# EAGLE design A (EAGLE 7.5.0)
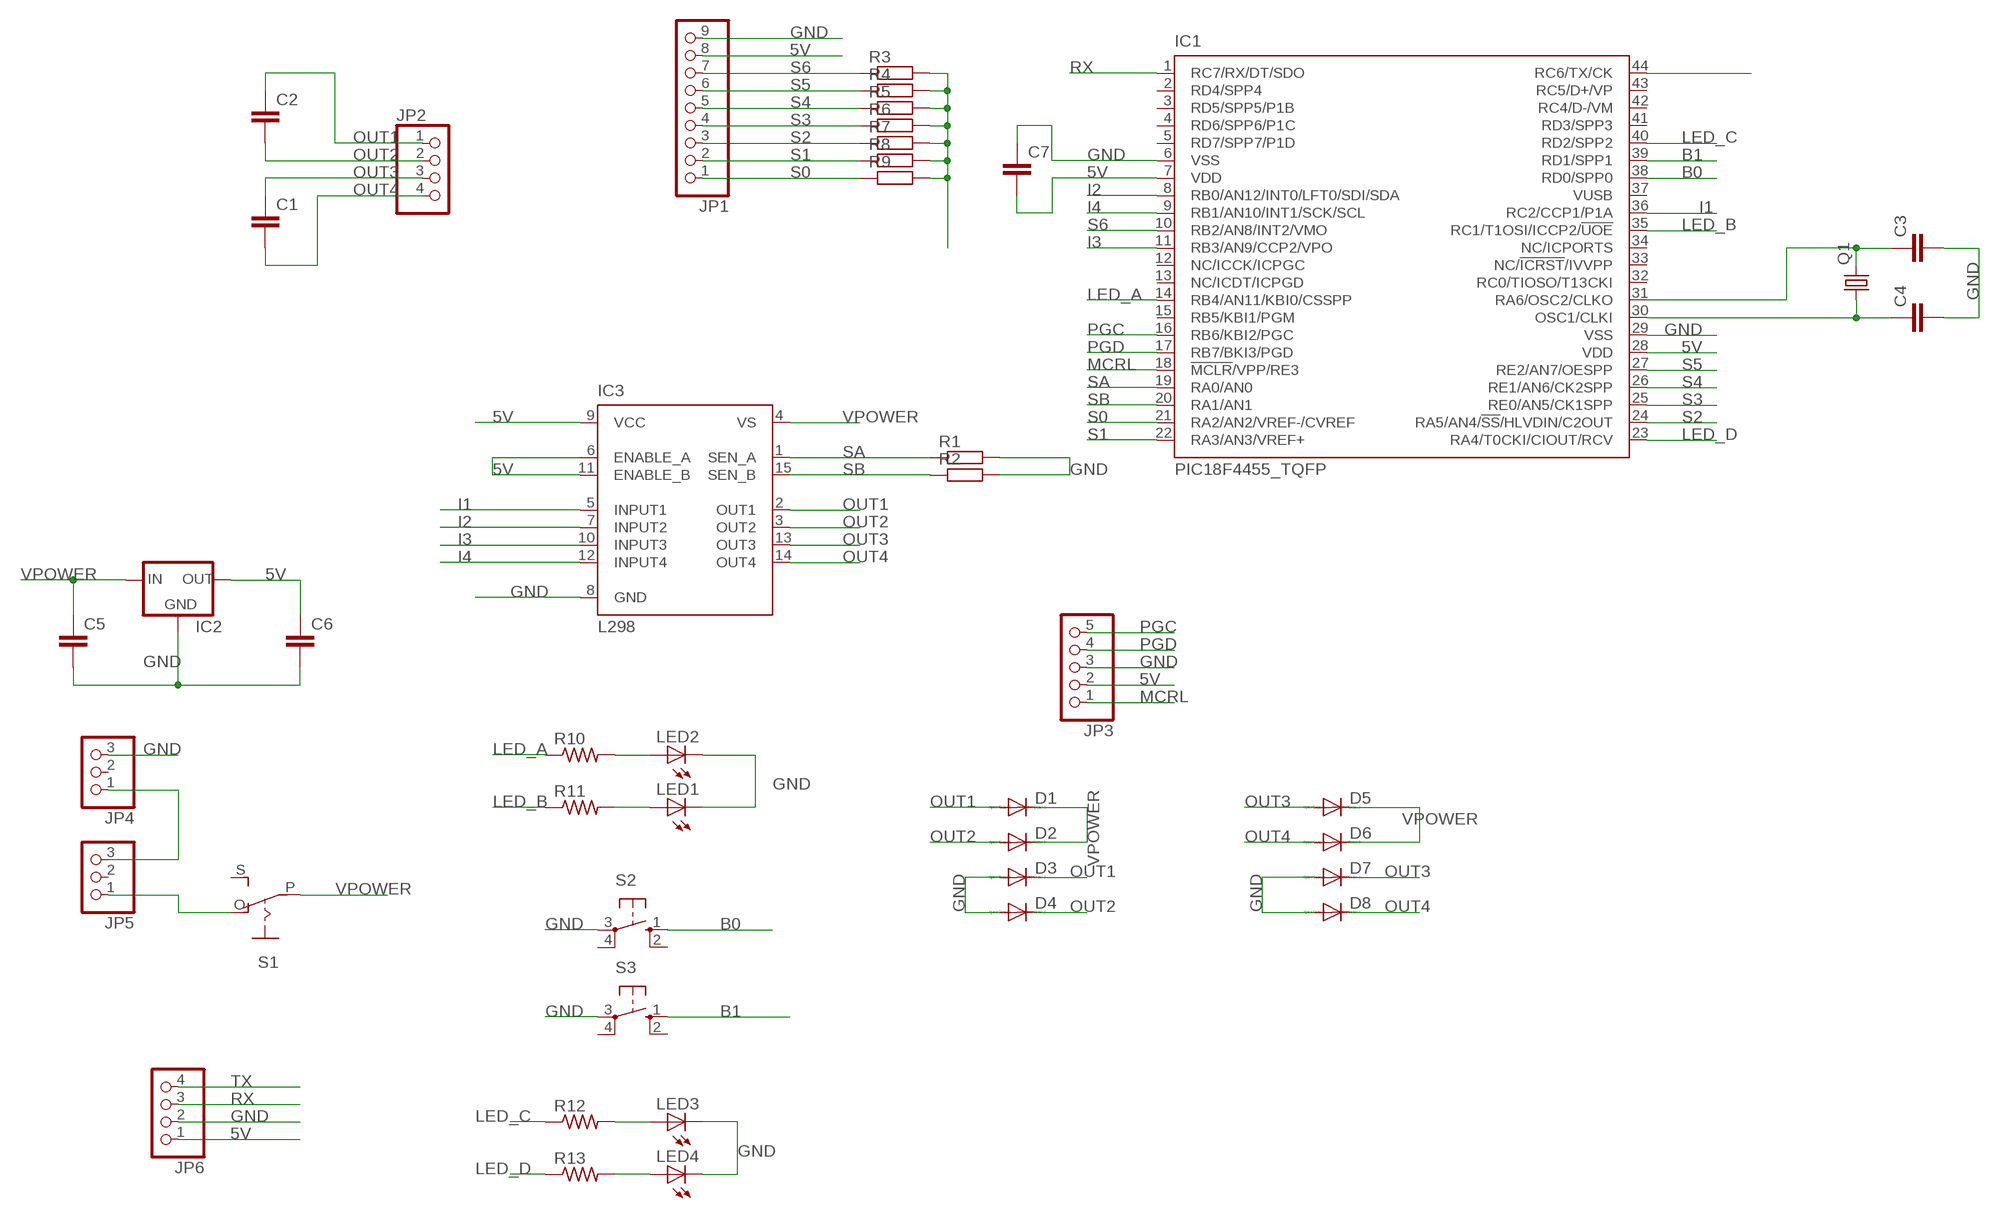
[diagram p0: schematic, sheet 1]

## Parts
C1  C2,5-3  [C2.5-3]
C2  C2,5-3  [C2.5-3]
C3  C2,5-3  [C2.5-3]
C4  C2,5-3  [C2.5-3]
C5  C2,5-3  [C2.5-3]
C6  C2,5-3  [C2.5-3]
C7  C2,5-3  [C2.5-3]
D1  DIODE-DO214AC  [DO214AC]
D2  DIODE-DO214AC  [DO214AC]
D3  DIODE-DO214AC  [DO214AC]
D4  DIODE-DO214AC  [DO214AC]
D5  DIODE-DO214AC  [DO214AC]
D6  DIODE-DO214AC  [DO214AC]
D7  DIODE-DO214AC  [DO214AC]
D8  DIODE-DO214AC  [DO214AC]
IC1  PIC18F4455_TQFP  [TQFP44]
IC2  78XXS  [78XXS]
IC3  L298  [MULTIWATT-15]
JP1  PINHD-1X9  [1X09]
JP2  PINHD-1X4  [1X04]
JP3  PINHD-1X5  [1X05]
JP4  PINHD-1X3  [1X03]
JP5  PINHD-1X3  [1X03]
JP6  PINHD-1X4  [1X04]
LED1  LEDCHIPLED_1206  [CHIPLED_1206]
LED2  LEDCHIPLED_1206  [CHIPLED_1206]
LED3  LEDCHIPLED_1206  [CHIPLED_1206]
LED4  LEDCHIPLED_1206  [CHIPLED_1206]
Q1  CRYSTALHC49S  [HC49/S]
R1  R-EU_R2512  [R2512]
R2  R-EU_R2512  [R2512]
R3  R-EU_M0805  [M0805]
R4  R-EU_M0805  [M0805]
R5  R-EU_M0805  [M0805]
R6  R-EU_M0805  [M0805]
R7  R-EU_M0805  [M0805]
R8  R-EU_M0805  [M0805]
R9  R-EU_M0805  [M0805]
R10  R-US_M0805  [M0805]
R11  R-US_M0805  [M0805]
R12  R-US_R0805  [R0805]
R13  R-US_R0805  [R0805]
S1  EG1218S  [EG1218]
S2  10-XX  [B3F-10XX]
S3  10-XX  [B3F-10XX]

## Nets
5V: C6.1 C7.2 IC1.7(VDD) IC1.28(VDD) IC2.OUT IC3.6(ENABLE_A) IC3.9(VCC) IC3.11(ENABLE_B) JP1.8 JP3.2 JP6.1 R3.2 R4.2 R5.2 R6.2 R7.2 R8.2 R9.2
B0: IC1.38(RD0/SPP0) S2.1(S)
B1: IC1.39(RD1/SPP1) S3.1(S)
GND: C3.2 C4.2 C5.2 C6.2 C7.1 D3.A D4.A D7.A D8.A IC1.6(VSS) IC1.29(VSS) IC2.GND IC3.8(GND) JP1.9 JP3.3 JP4.3 JP6.2 LED1.C LED2.C LED3.C LED4.C R1.2 R2.2 S2.3(P) S3.3(P)
I1: IC1.36(RC2/CCP1/P1A) IC3.5(INPUT1)
I2: IC1.8(RB0/AN12/INT0/LFT0/SDI/SDA) IC3.7(INPUT2)
I3: IC1.11(RB3/AN9/CCP2/VPO) IC3.10(INPUT3)
I4: IC1.9(RB1/AN10/INT1/SCK/SCL) IC3.12(INPUT4)
LED_A: IC1.14(RB4/AN11/KBI0/CSSPP) R10.1
LED_B: IC1.35(RC1/T1OSI/ICCP2/!UOE) R11.1
LED_C: IC1.40(RD2/SPP2) R12.1
LED_D: IC1.23(RA4/T0CKI/CIOUT/RCV) R13.1
MCRL: IC1.18(!MCLR!/VPP/RE3) JP3.1
N$17: C4.1 IC1.30(OSC1/CLKI) Q1.1
N$18: C3.1 IC1.31(RA6/OSC2/CLKO) Q1.2
N$19: JP4.1 JP5.3
N$20: LED2.A R10.2
N$21: LED1.A R11.2
N$24: LED3.A R12.2
N$25: LED4.A R13.2
OUT1: C2.1 D1.A D3.C IC3.2(OUT1) JP2.1
OUT2: C2.2 D2.A D4.C IC3.3(OUT2) JP2.2
OUT3: C1.1 D5.A D7.C IC3.13(OUT3) JP2.3
OUT4: C1.2 D6.A D8.C IC3.14(OUT4) JP2.4
PGC: IC1.16(RB6/KBI2/PGC) JP3.5
PGD: IC1.17(RB7/BKI3/PGD) JP3.4
RX: IC1.1(RC7/RX/DT/SDO) JP6.3
S0: IC1.21(RA2/AN2/VREF-/CVREF) JP1.1 R9.1
S1: IC1.22(RA3/AN3/VREF+) JP1.2 R8.1
S2: IC1.24(RA5/AN4/!SS!/HLVDIN/C2OUT) JP1.3 R7.1
S3: IC1.25(RE0/AN5/CK1SPP) JP1.4 R6.1
S4: IC1.26(RE1/AN6/CK2SPP) JP1.5 R5.1
S5: IC1.27(RE2/AN7/OESPP) JP1.6 R4.1
S6: IC1.10(RB2/AN8/INT2/VMO) JP1.7 R3.1
SA: IC1.19(RA0/AN0) IC3.1(SEN_A) R1.1
SB: IC1.20(RA1/AN1) IC3.15(SEN_B) R2.1
TX: IC1.44(RC6/TX/CK) JP6.4
VPOWER: C5.1 D1.C D2.C D5.C D6.C IC2.IN IC3.4(VS) S1.P
VPREV: JP5.1 S1.O
Unconnected: IC1.2(RD4/SPP4) IC1.3(RD5/SPP5/P1B) IC1.4(RD6/SPP6/P1C) IC1.5(RD7/SPP7/P1D) IC1.12(NC/ICCK/ICPGC) IC1.13(NC/ICDT/ICPGD) IC1.15(RB5/KBI1/PGM) IC1.32(RC0/TIOSO/T13CKI) IC1.33(NC/!ICRST!/IVVPP) IC1.34(NC/ICPORTS) IC1.37(VUSB) IC1.41(RD3/SPP3) IC1.42(RC4/D-/VM) IC1.43(RC5/D+/VP) JP4.2 JP5.2 S1.S S2.2(S1) S2.4(P1) S3.2(S1) S3.4(P1)

## Library data of the parts
C1-C7 = capacitor-wima:C: CAPACITOR naming: grid - package width
D1-D8 = diode:DIODE-: DIODE
IC1 = microchip:PIC18F4*_TQFP: USB Microcontrollers with nanoWatt Technology High-Performance, Enhanced Flash, 28/40/44-Pin, Source: http://ww1.microchip.com/downloads/en/devicedoc/39632c.pdf; MF: MICROCHIP; MPN: PIC18F4455-I/PT; OC_FARNELL: 9321322; OC_NEWARK: 08J9628
IC2 = v-reg:78XXS: VOLTAGE REGULATOR
IC3 = st-microelectronics:L298: DUAL FULL-BRIDGE DRIVER; MPN: L298N; OC_FARNELL: 1589425; OC_NEWARK: 32M1527
JP1 = pinhead:PINHD-1X9: PIN HEADER
JP2 JP6 = pinhead:PINHD-1X4: PIN HEADER
JP3 = pinhead:PINHD-1X5: PIN HEADER
JP4 JP5 = pinhead:PINHD-1X3: PIN HEADER
LED1-LED4 = adafruit:LED: LED OSRAM: - CHIPLED LG R971, LG N971, LY N971, LG Q971, LY Q971, LO R971, LY R971 LH N974, LH R974 LS Q976, LO Q976, LY Q976 LO Q996 - Hyper CHIPLED LW Q18S LB Q993, LB Q99A, LB R99A - SideLED LS A670, LO A670, LY A670, LG A670, LP A670 LB A673, LV A673, LT A673, LW A673 LH A674 LY A675 LS A676, LA A676, LO A676, LY A676, LW A676 LS A679, LY A679, LG A679 - Hyper Micro SIDELED® LS Y876, LA Y876, LO Y876, LY Y876 LT Y87S - SmartLED LW L88C, LW L88S LB L89C, LB L89S, LG L890 LS L89K, LO L89K, LY L89K LS L896, LA L896, LO L896, LY L896 - TOPLED LS T670, LO T670, LY T670, LG T670, LP T670 LSG T670, LSP T670, LSY T670, LOP T670, LYG T670 LG T671, LOG T671, LSG T671 LB T673, LV T673, LT T673, LW T673 LH T674 LS T676, LA T676, LO T676, LY T676, LB T676, LH T676, LSB T676, LW T676 LB T67C, LV T67C, LT T67C, LS T67K, LO T67K, LY T67K, LW E67C LS E67B, LA E67B, LO E67B, LY E67B, LB E67C, LV E67C, LT E67C LW T67C LS T679, LY T679, LG T679 LS T770, LO T770, LY T770, LG T770, LP T770 LB T773, LV T773, LT T773, LW T773 LH T774 LS E675, LA E675, LY E675, LS T675 LS T776, LA T776, LO T776, LY T776, LB T776 LHGB T686 LT T68C, LB T68C - Hyper Mini TOPLED® LB M676 - Mini TOPLED Santana® LG M470 LS M47K, LO M47K, LY M47K Source: http://www.osram.convergy.de/
Q1 = crystal:CRYSTAL: CRYSTAL; OC_FARNELL: 1667008; OC_NEWARK: unknown
R1-R9 = resistor:R-EU_: RESISTOR, European symbol
R10 R11 = adafruit:R-US_: RESISTOR, American symbol
R12 R13 = resistor:R-US_: RESISTOR, American symbol
S1 = adafruit:EG1218: SLIDING SWITCH 0.1" spacing through hole, vertical SPDT slide switch http://www.ladyada.net/library/pcb/eaglelibrary.html
S2 S3 = switch-omron:10-XX: OMRON SWITCH; MPN: B3F-1000; OC_FARNELL: 176432; OC_NEWARK: 36M3542

## Board
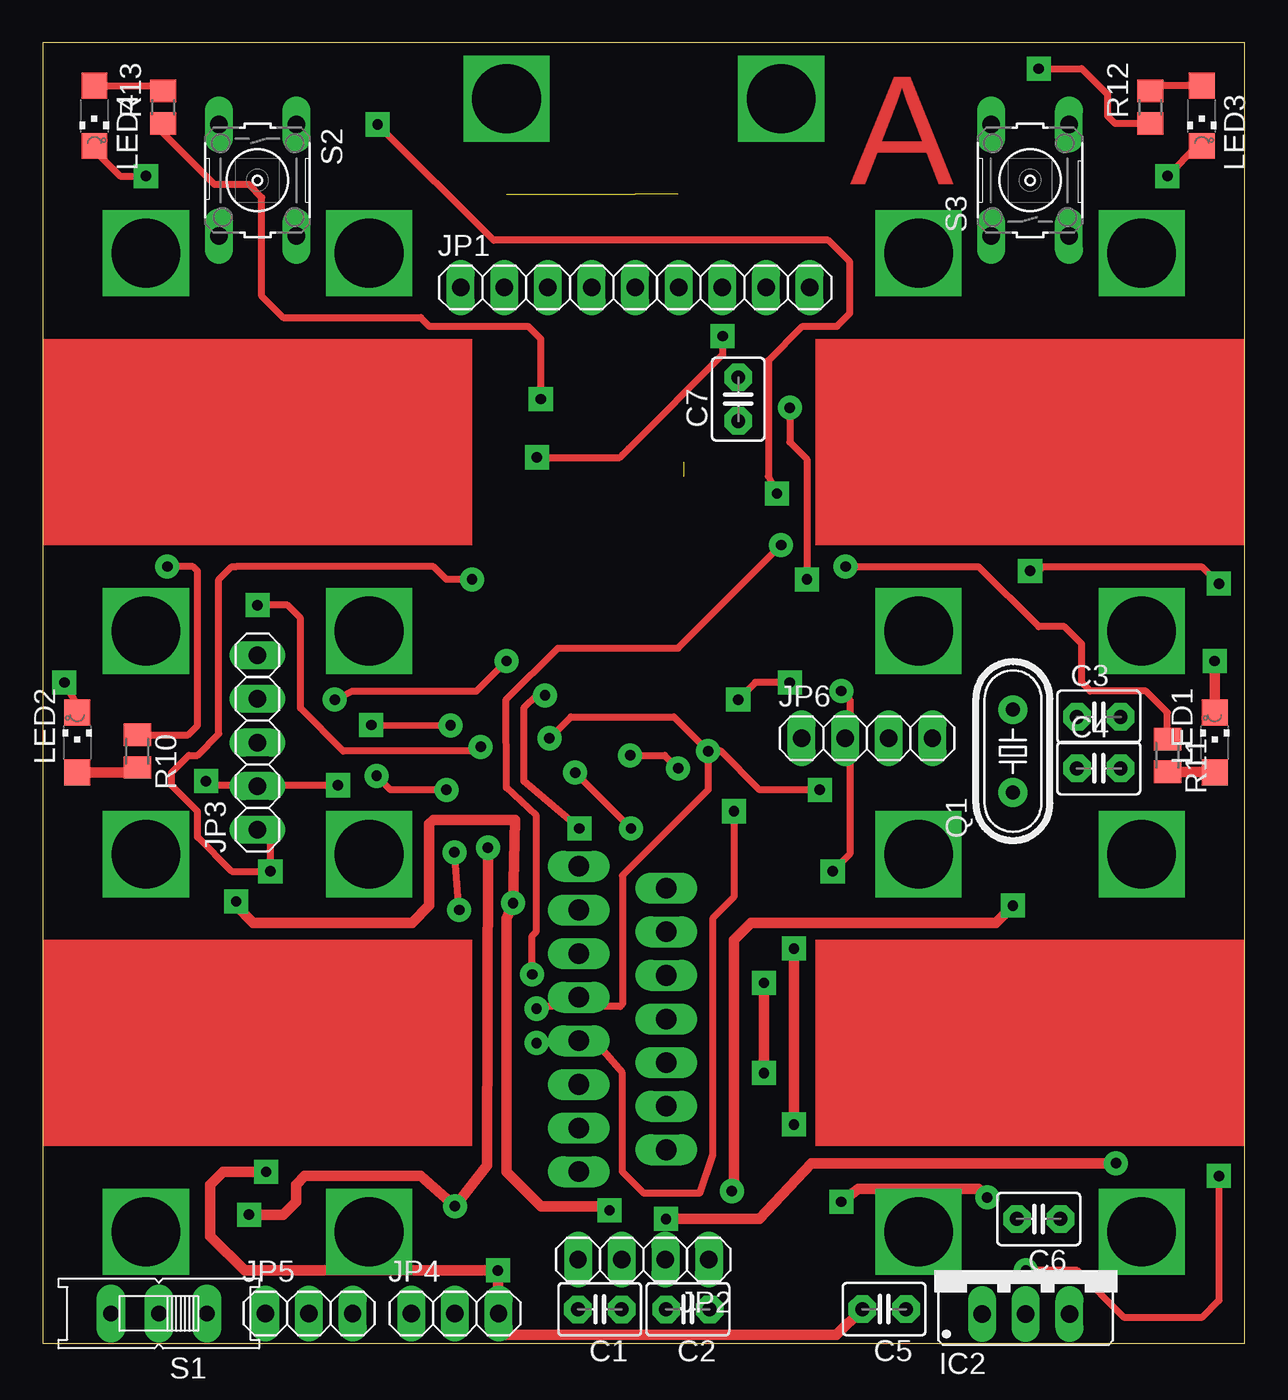
[diagram p1: board, top side]
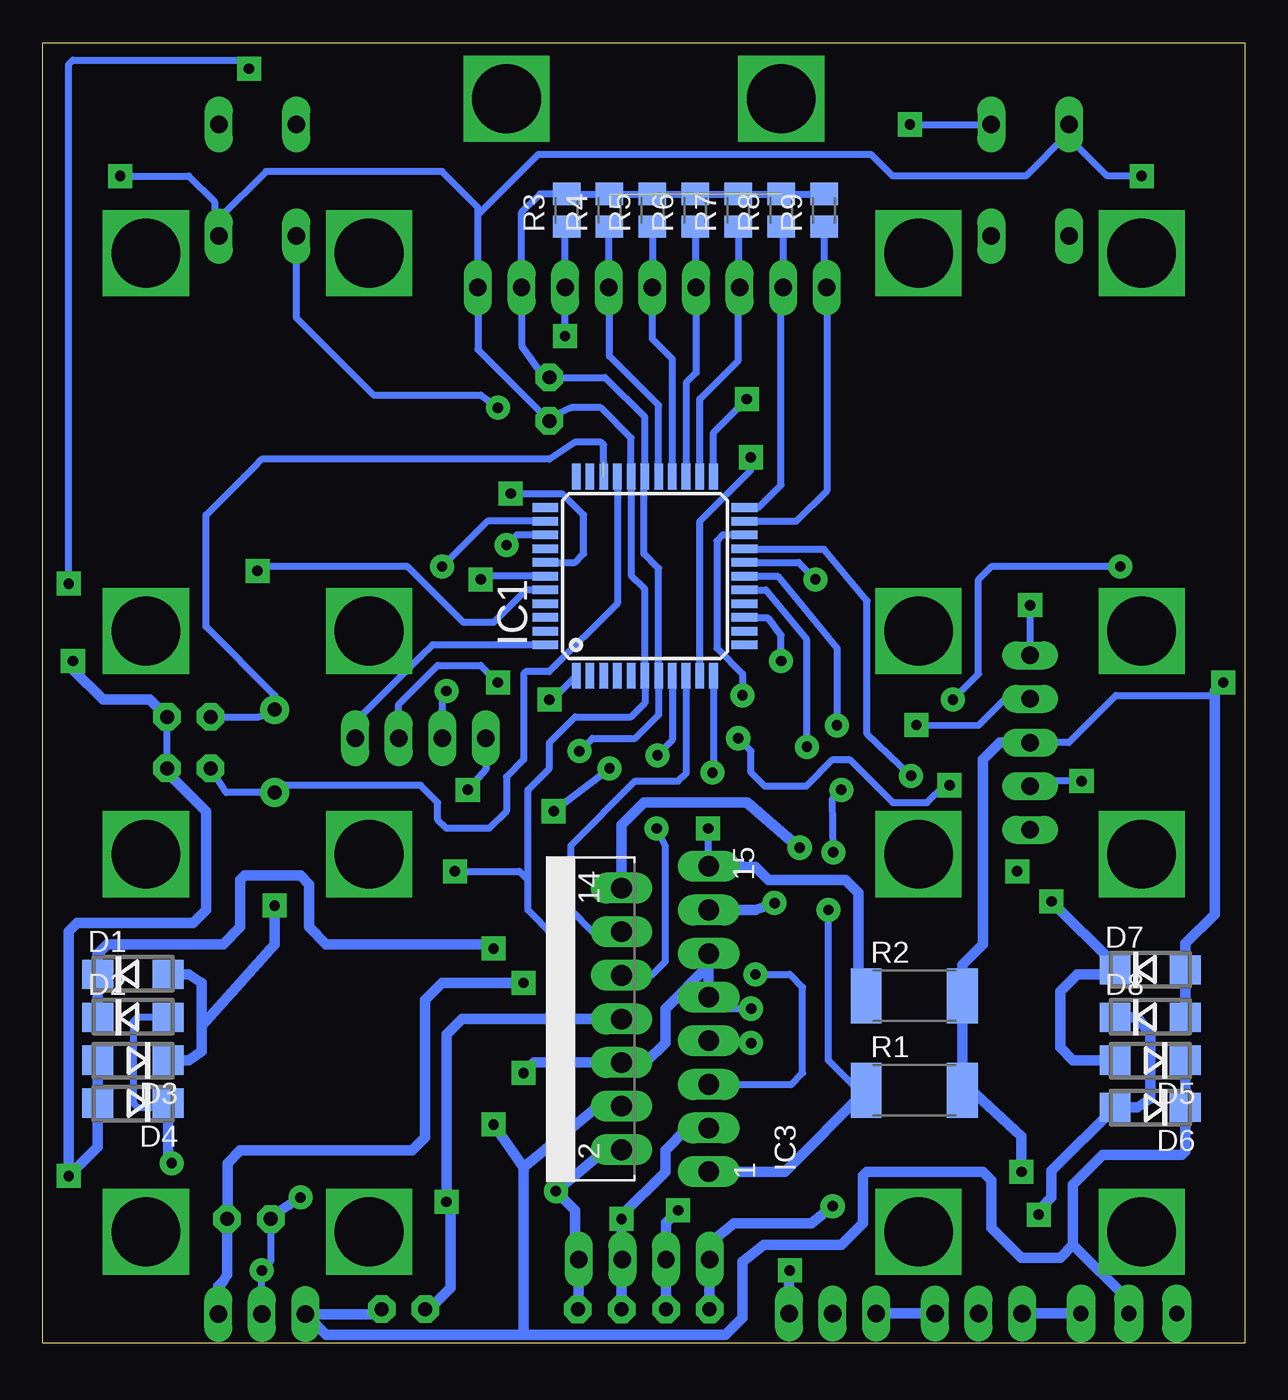
[diagram p2: board, bottom side, seen from below]

Size 70 x 75.75 mm. Coordinates in mm from the lower left corner, seen from the top.
Outline: 0,0 70,0 70,75.75 0,75.75 0,0
Copper layers (1*16): Top 0.035mm / dielectric 1.5mm / Bottom 0.035mm
Design rules "default *": minimum track width 10mil, minimum drill 24mil, track to track 8mil, track to pad 8mil, pad to pad 8mil, via to via 8mil, smd to smd 8mil, copper to edge 40mil, drill to drill 8mil, minimum pad ring 0.3mm, minimum via ring 0.4mm, stop-mask expansion 4mil, vias tented up to drill 0mil, thermal gap 10mil

### Footprints (pad centres in the part's own frame; a part is rotated, then mirrored left to right if it is on the bottom)
C2.5-3 = drill 0.813 pad 1.6 octagon: 1 -1.27,0; 2 1.27,0
DO214AC = smd 1.8 x 1.7: A 2.05,0; C -2.05,0
TQFP44 = smd 1.5 x 0.5: 1 -5.8,4; 2 -5.8,3.2; 3 -5.8,2.4; 4 -5.8,1.6; 5 -5.8,0.8; 6 -5.8,0; 7 -5.8,-0.8; 8 -5.8,-1.6; 9 -5.8,-2.4; 10 -5.8,-3.2; 11 -5.8,-4; 23 5.8,-4; 24 5.8,-3.2; 25 5.8,-2.4; 26 5.8,-1.6; 27 5.8,-0.8; 28 5.8,0; 29 5.8,0.8; 30 5.8,1.6; 31 5.8,2.4; 32 5.8,3.2; 33 5.8,4 | smd 0.5 x 1.5: 12 -4,-5.8; 13 -3.2,-5.8; 14 -2.4,-5.8; 15 -1.6,-5.8; 16 -0.8,-5.8; 17 0,-5.8; 18 0.8,-5.8; 19 1.6,-5.8; 20 2.4,-5.8; 21 3.2,-5.8; 22 4,-5.8; 34 4,5.8; 35 3.2,5.8; 36 2.4,5.8; 37 1.6,5.8; 38 0.8,5.8; 39 0,5.8; 40 -0.8,5.8; 41 -1.6,5.8; 42 -2.4,5.8; 43 -3.2,5.8; 44 -4,5.8
78XXS = drill 1.016 long: GND 0,-2.54; IN -2.54,-2.54; OUT 2.54,-2.54
MULTIWATT-15 = drill 1.2 long: 1 -8.89,-7.62; 2 -7.62,-2.54; 3 -6.35,-7.62; 4 -5.08,-2.54; 5 -3.81,-7.62; 6 -2.54,-2.54; 7 -1.27,-7.62; 8 0,-2.54; 9 1.27,-7.62; 10 2.54,-2.54; 11 3.81,-7.62; 12 5.08,-2.54; 13 6.35,-7.62; 14 7.62,-2.54; 15 8.89,-7.62
1X09 = drill 1.016 long: 1 -10.16,0; 2 -7.62,0; 3 -5.08,0; 4 -2.54,0; 5 0,0; 6 2.54,0; 7 5.08,0; 8 7.62,0; 9 10.16,0
1X04 = drill 1.016 long: 1 -3.81,0; 2 -1.27,0; 3 1.27,0; 4 3.81,0
1X05 = drill 1.016 long: 1 -5.08,0; 2 -2.54,0; 3 0,0; 4 2.54,0; 5 5.08,0
1X03 = drill 1.016 long: 1 -2.54,0; 2 0,0; 3 2.54,0
CHIPLED_1206 = smd 1.5 x 1.5: A 0,-1.75; C 0,1.75
HC49/S = drill 0.813 pad 1.676: 1 -2.413,0; 2 2.413,0
R2512 = smd 1.8 x 3.2: 1 -2.8,0; 2 2.8,0
M0805 = smd 1.3 x 1.6: 1 -0.95,0; 2 0.95,0
R0805 = smd 1.3 x 1.5: 1 -0.95,0; 2 0.95,0
EG1218 = drill 0.9 pad 1.676 long: O -2.794,0; P 0,0; S 2.794,0
B3F-10XX = drill 1.016 long: 1 -3.251,2.261; 2 3.251,2.261; 3 -3.251,-2.261; 4 3.251,-2.261

### Placement (x,y rotation side)
C1  32.44,1.99 180 top
C2  37.57,1.99 180 top
C3  61.5,36.5 0 top
C4  61.5,33.5 0 top
C5  49,2 180 top
C6  58,7.25 180 top
C7  40.5,55 90 top
D1  64.75,21.5 0 bottom
D2  64.75,19 0 bottom
D3  64.75,16.5 180 bottom
D4  64.75,14 180 bottom
D5  5.5,16.5 180 bottom
D6  5.5,13.75 180 bottom
D7  5.5,21.75 0 bottom
D8  5.5,19 0 bottom
IC1  34.94,44.69 90 bottom
IC2  57.25,4.25 0 top
IC3  38.84,18.9 90 bottom
JP1  34.5,61.5 0 top
JP2  34.98,4.88 180 top
JP3  12.5,35 90 top
JP4  24,1.75 0 top
JP5  15.5,1.75 0 top
JP6  48,35.25 0 top
LED1  68.25,35 0 top
LED2  2,35 0 top
LED3  67.5,71.5 180 top
LED4  3,71.5 180 top
Q1  56.5,34.5 90 top
R1  19.25,14.75 0 bottom
R2  19.25,20.25 0 bottom
R3  39.5,66 90 bottom
R4  37,66 90 bottom
R5  34.5,66 90 bottom
R6  32,66 90 bottom
R7  29.5,66 90 bottom
R8  27,66 90 bottom
R9  24.5,66 90 bottom
R10  5.5,34.5 270 top
R11  65.5,34.25 270 top
R12  64.5,72 90 top
R13  7,72 90 top
S1  6.75,1.75 180 top
S2  12.5,67.75 270 top
S3  57.5,67.75 90 top

### Tracks (layer width: path | path; a pad name or v marks a point on that pad's centre or on a via)
5V  (via drill 0.6)  (4 unrouted)
  Top 0.406: v38.75,34.5 38.75,32.25 33.75,27.25 33.75,19.75 33.62,19.62 29.12,19.62 v28.75,19.5 | v17.19,32.51 10.25,32.5 v9.5,32.75 | v29.5,35.25 30.75,36.5 36.75,36.5 v38.75,34.5 | v45.25,32.25 41.75,32.25 39.5,34.5 v38.75,34.5
  Top 0.61: v42,21 v42,15.75
  Bottom 0.406: R9.2 R4.2 R3.2 41.05,66.95 42.12,65.88 JP1.8 42.12,58.12 40.77,56.27 C7.2 37.27,56.27 34.94,53.94 IC1.28 35,50.43 35,46 34.14,45.14 IC1.7 34.14,36.61 35.5,35.25 38,35.25 v38.75,34.5 | 59.79,6.98 C6.1 | v29.5,35.25 28.75,34.5 28.75,33.25 27.96,32.46 25.54,32.46 24,34 23,34 20.5,31.5 18.5,31.5 17.5,32.5 v17.19,32.51 | v9.5,32.75 11.96,32.75 JP3.2 | JP6.1 44.19,33.44 v45.25,32.25 | v28.75,19.5 30.55,19.5 IC3.9
  Bottom 0.61: 59.53,3.6 59.27,4 C6.1 59.25,7.27 59.25,10.5 58.5,11.25 48.5,11.25 47.75,12 47.75,20 46.75,21 v42,21 | 59.53,3.6 59.77,3.23 | IC2.OUT 59.79,3.34 59.53,3.6 | IC3.9 IC3.11 31.22,22.03 33.75,19.5 33.75,17.5 34.89,16.36 IC3.6 41.39,16.36 v42,15.75
B0  (via drill 0.6)
  Top 0.406: v19.5,71 26.25,64.25 45.75,64.25 47,63 47,60 46.25,59.25 44.25,59.25 42.25,57.25 42.25,50.5 v42.75,49.5
  Bottom 0.406: IC1.38 39.01,45.49 38.5,46 38.5,48.25 39.75,49.5 v42.75,49.5 | v19.5,71 S2.1
B1  (via drill 0.6)
  Top 0.406: v43.5,54.5 43.5,52.5 44.5,51.5 v44.5,44.5
  Bottom 0.406: S3.1 55.24,59.74 50.75,55.25 44.5,55.25 v43.5,54.5 | IC1.39 44.06,44.69 v44.5,44.5
GND  (via drill 0.6)
  Top 0.406: v68.5,9.75 68.5,2.5 67.5,1.5 63,1.5 60.25,4.25 v57.25,4.25 | LED2.C 2.25,36.75 v1.25,38.5 | v46.5,38 47,37.5 47,28.5 v46,27.5 | LED3.C 67.25,69.75 v65.5,68 | LED4.C 3,69.5 4.5,68 v6,68
  Top 0.61: v46.5,8.25 47.5,9 54.5,9 v55,8.5 | LED1.C v68.25,39.75 | C5.2 46.23,0.5 27,0.5 26.5,1 v26.5,4.25 11.75,4.25 9.75,6.25 9.75,9.25 10.5,10 v13,10
  Bottom 0.406: C4.2 C3.2 | IC2.GND v57.25,4.25 56.75,4.75 56.75,6.98 C6.2 | 44.66,65.75 JP1.9 44.66,57.89 C7.1 40.23,54 39.23,54.5 37.5,54.5 35.74,52.74 IC1.29 35.74,44.74 34.94,43.94 IC1.6 34.94,37.31 35.75,36.5 39,36.5 40.5,35 40.5,33.5 41.75,32.25 41.75,27 | 44.66,65.75 44.66,66.16 46.75,68.25 57,68.25 59.75,65.5 S3.3 60,64.74 60,66.5 61.5,68 v65.5,68 | S2.3 10.24,70.51 10.38,70.38 | 10.38,70.38 12.75,68 20.5,68 21.75,69.25 41.16,69.25 44.66,65.75 | 13,35 10.25,35 7.5,37.75 2,37.75 v1.25,38.5 | IC3.8 39.15,18.9 40.25,20 40.25,23.75 41.75,25.25 41.75,27 | JP6.2 46.73,37.77 v46.5,38 | v46,27.5 42.25,27.5 41.75,27 | v6,68 8,68 10.38,70.38
  Bottom 0.61: C5.2 47.25,2.25 46.25,3.25 46.25,8 v46.5,8.25 46.5,18 45.6,18.9 IC3.8 | v55,8.5 56.5,7.52 C6.2 | v68.25,39.75 68.25,39.25 66.5,37.5 63.77,37.5 C3.2 | D3.A D4.A 66.8,11.45 v68.5,9.75 68.5,24 68,24.5 61.25,24.5 60.5,25.25 60.5,31 62.77,33.27 C4.2 | D8.A D7.A 3.45,23.3 1.75,25 1.75,38 v1.25,38.5 | 16.45,15.25 R2.2 16.45,22.05 15.25,23.25 15.25,34 14.25,35 13,35 JP3.3 | 16.45,15.25 R1.2 | R1.2 16.45,14.55 16.75,14.25 16.75,14.45 R1.2 | JP4.3 26.54,4.21 v26.5,4.25 | v13,10 13,12.05 16.45,15.25
I1  (via drill 0.6)
  Top 0.406: v28.5,21.5 28.5,23.75 28.75,24 28.75,30.75 27,32.37 26.99,37.52 30,40.5 37,40.5 v43,46.5
  Bottom 0.406: IC1.36 42.41,47.09 v43,46.5 | IC3.5 26.41,15.09 25.75,15.75 25.75,20.75 26.5,21.5 v28.5,21.5
I2  (via drill 0.6)
  Top 0.406: v34.2,34.26 36.21,34.26 v37,33.5 | v40.25,31 40.25,26 39,24.75 39,11 38.25,8.75 35,8.75 33.75,10 33.75,15.75 32.25,17.5 v28.75,17.5
  Bottom 0.406: IC1.8 33.34,35.16 v34.2,34.26 | v37,33.5 37.25,33.25 v40.25,31 | v28.75,17.5 31.09,17.5 IC3.7
I3  (via drill 0.6)
  Top 0.406: v34.25,30 v31,33.25
  Bottom 0.406: IC3.10 34.56,21.44 33.75,22.25 33.75,29 v34.25,30 | IC1.11 30.94,33.31 v31,33.25
I4
  Bottom 0.406: IC3.12 37.98,23.98 39.25,25.25 39.25,29 35.5,32.75 33,32.75 32.54,33.21 IC1.9
LED_A  (via drill 0.6)
  Top 0.406: R10.1 8.45,35.45 9,36 9,45 8.75,45.25 v7.25,45.25 | v17,37.5 18,38 25.25,38 v27,39.75
  Bottom 0.406: v17,37.5 15.5,39 15.5,44.5 14.75,45.25 v7.25,45.25 | v27,39.75 27,41.25 27.75,42.25 29.1,42.25 IC1.14
LED_B  (via drill 0.6)
  Top 0.406: R11.1 65.5,36.75 64.25,38 61,38 60.5,38.5 60.5,40.75 59.5,41.75 58,41.75 54.5,45.25 v46.75,45.25
  Bottom 0.406: IC1.35 44.11,47.89 v46.75,45.25
LED_C  (via drill 0.6)
  Top 0.406: v57.5,45 58,45 58.25,45.25 67.5,45.25 v68.5,44.25 | v58,74.25 60.5,74.25 62,72.75 62,71.5 62.45,71.05 R12.1
  Bottom 0.406: IC1.40 41.86,43.89 43.75,42 45.5,42 48.75,45.25 57.25,45.25 v57.5,45 | v68.5,44.25 68.5,74.5 68.25,74.75 58.5,74.75 v58,74.25
LED_D  (via drill 0.6)
  Top 0.406: v29,55 29,58.5 28.25,59.25 22.5,59.25 22,59.75 14,59.75 12.75,61 12.75,66.75 12,67.5 10,67.5 7,70.5 R13.1
  Bottom 0.406: IC1.23 30.94,53.06 v29,55
MCRL  (via drill 0.6)
  Top 0.406: v25,44.5 23.5,44.5 22.75,45.25 11.25,45.25 11,45.25 10.25,44.5 10.25,35.5 9,34.25 8.5,34.25 7.5,33.25 7.5,32.5 9,31 9,29.5 11,27.5 v13.25,27.5 13.25,29.17 JP3.1
  Bottom 0.406: IC1.18 25.99,45.49 v25,44.5
N$1  (via drill 4)
  other vias: 19,63.5
N$2  (via drill 4)
  other vias: 6,63.5
N$3  (via drill 4)
  other vias: 6,28.5
N$4  (via drill 4)
  other vias: 6,6.5
N$5  (via drill 4)
  other vias: 19,41.5
N$6  (via drill 4)
  other vias: 6,41.5
N$7  (via drill 4)
  other vias: 19,6.5
N$8  (via drill 4)
  other vias: 19,28.5
N$9  (via drill 4)
  other vias: 51,63.5
N$10  (via drill 4)
  other vias: 64,63.5
N$11  (via drill 4)
  other vias: 51,41.5
N$12  (via drill 4)
  other vias: 64,41.5
N$13  (via drill 4)
  other vias: 51,28.5
N$14  (via drill 4)
  other vias: 51,6.5
N$15  (via drill 4)
  other vias: 64,6.5
N$16  (via drill 4)
  other vias: 64,28.5
N$17
  Bottom 0.406: Q1.1 57,32.09 | 57,32.09 59.32,32.09 C4.1 | IC1.30 36.54,43.1 40.52,39.12 41.88,39.12 42,39 42,34 43,33 43,31 44,30 46.5,30 47,30.5 47,31.5 48,32.5 56.59,32.5 57,32.09
N$18  (1 unrouted)
  Bottom 0.406: C3.1 57.41,36.5 Q1.2 56.5,37.75 60.5,41.75 60.5,48.25 58.25,50.5 57.75,51 57.25,51.5 40.5,51.5 39,52.5 37.5,52.5 37.34,52.34 37.34,51.34
N$19
  Bottom 0.61: JP5.3 JP4.1
N$20
  Top 0.61: LED2.A 4.95,33.25 R10.2
N$21
  Top 0.61: R11.2 68.2,33.3 LED1.A
N$22  (via drill 4)
  other vias: 27,72.5
N$23  (via drill 4)
  other vias: 43,72.5
N$24
  Top 0.406: LED3.A 64.8,73.25 R12.2
N$25
  Top 0.406: LED4.A 6.7,73.25 R13.2
OUT1  (via drill 0.6)
  Top 0.61: v56.5,25.5 55.5,24.5 41.25,24.5 40.25,23.5 40.25,9 v40.12,8.88
  Bottom 0.61: C2.1 38.79,2.79 JP2.1 39,5.09 39,7.75 v40.12,8.88 37.22,11.28 IC3.2 | D1.A 61.5,21.5 60.75,21 60.75,18.5 | D3.C 61.5,16.5 60.75,17 60.75,18.5 | 60.75,18.5 56.5,23.25 v56.5,25.5
OUT2  (via drill 0.6)
  Top 0.61: v62.5,10.5 44.75,10.5 41.75,7.25 v36.3,7.25
  Bottom 0.406: D2.A 64.5,19 64.75,18.75 64.75,14 64.5,13.75 62.95,13.75 D4.C
  Bottom 0.61: C2.2 36.3,5.34 | 36.3,5.34 JP2.2 | 36.3,5.34 v36.3,7.25 36.3,7.45 33.75,10 33.75,11.25 32.5,12.5 31.27,12.5 IC3.3 | D4.C 62.7,10.95 v62.5,10.5
OUT3  (via drill 0.6)
  Top 0.61: v33,7.75 32.75,8 29,8 27,10 27,24.75 v27.38,25.65 27.5,30.5 22.75,30.5 22.5,30.25 22.5,25.5 21.5,24.5 12.25,24.5 11.25,25.5 v11.25,25.75
  Bottom 0.61: C1.1 JP2.3 33.71,7.04 v33,7.75 | v27.38,25.65 28.5,25.25 IC3.13 | D5.A 10,16.5 10.75,17.25 10.75,20.5 9.75,21.5 7.8,21.5 D7.C 7.55,22.05 v11.25,25.75
OUT4  (via drill 0.6)
  Top 0.61: v12,7.5 14,7.5 14.75,8.25 14.75,9.25 15.25,9.75 22,9.75 v24,8 25.88,10.38 v25.92,28.88
  Bottom 0.61: JP2.4 C1.2 31.17,5.83 29.75,7 25.25,7 v24,8 | D8.C 6.25,19 5.5,18 5.5,14.25 6.25,13.75 D6.A 11.25,10.05 11.25,8.5 12,7.75 v12,7.5 | IC3.14 36.3,30.2 35,31.5 29,31.5 v25.92,28.88
PGC  (via drill 0.6)
  Top 0.406: v12.5,43 14.25,43 15,42.25 15,37 17.5,34.5 25.25,34.5 v25.5,34.75
  Bottom 0.406: IC1.16 27.89,43.89 25.5,41 v25.5,34.75 | v12.5,43 JP3.5
PGD  (via drill 0.6)
  Top 0.406: v19.13,36.02 v23.75,36
  Bottom 0.406: IC1.17 27.19,44.69 23.75,40.5 v23.75,36 | v19.13,36.02 15.5,36 14,37.5 12.54,37.5 JP3.4
RX  (via drill 0.6)
  Top 0.406: v43.5,38.5 41.5,38.5 v40.5,37.5
  Bottom 0.406: JP6.3 49.27,37.23 47,39.5 44.5,39.5 v43.5,38.5 | v40.5,37.5 40.33,37.5 IC1.1
S0
  Bottom 0.406: IC1.21 26.11,47.89 24.34,49.66 JP1.1 24.5,61.66 R9.1
S1
  Bottom 0.406: IC1.22 28.31,48.69 27,50 27,61.38 JP1.2 26.88,64.93 R8.1
S2
  Bottom 0.406: IC1.24 31.74,55.01 29.5,57.25 29.5,61.42 JP1.3 29.5,61.58 R7.1
S3
  Bottom 0.406: IC1.25 32.54,50.96 32.5,51 32.5,56 31.96,56.54 JP1.4 31.96,65.01 R6.1
S4
  Bottom 0.406: R5.1 JP1.5 34.5,58.5 33.34,57.34 IC1.26
S5
  Bottom 0.406: IC1.27 34.14,54.64 37,57.5 37,61.46 JP1.6 37.04,65.01 R4.1
S6  (via drill 0.6)
  Top 0.406: v28.77,51.61 33.61,51.61 33.75,51.75 34.12,52.12 39.59,57.59 v39.59,58.67
  Bottom 0.406: R3.1 39.58,64.97 JP1.7 39.59,61.49 v39.59,58.67 | IC1.10 31.74,47.89 28.77,50.86 v28.77,51.61
SA  (via drill 0.6)
  Top 0.406: v24.25,25.25 v23.97,28.61 | v23.5,32.25 20.25,32.25 v19.43,33.06
  Bottom 0.406: R1.1 22.5,14.75 24.25,16.5 v24.25,25.25 | v23.97,28.61 24,31.75 v23.5,32.25 | v19.43,33.06 22,35.5 22,43.25 24.5,46.25 29.1,46.25 IC1.19
  Bottom 0.61: IC3.1 26.79,10.01 R1.1
SB  (via drill 0.6)
  Top 0.406: v29.25,37.75 28.75,37.75 28,37 28,32.75 v31.25,30
  Bottom 0.406: IC1.20 30.41,47.09 30.75,46.75 30.75,40.5 29.25,39 v29.25,37.75 | v31.25,30 31.25,27.82 IC3.15
  Bottom 0.61: 22.05,21.05 R2.1 22.5,20.7 22.5,26.25 23.25,27 27.75,27 28.5,27.75 31.18,27.75 IC3.15
TX
  Bottom 0.406: JP6.4 51.81,36.19 48.25,39.75 48,40 47.31,40.69 IC1.44
VPOWER  (via drill 0.6)
  Top 0.61: v43.75,23 v43.75,12.75
  Bottom 0.61: C5.1 50.81,1.71 IC2.IN 53.5,0.5 42,0.5 | 42,0.5 30.25,0.5 29.25,1.5 29.25,4.75 28,5.75 23.5,5.75 22.25,7 22.25,9.75 22,10 15.25,10 14.75,9.5 14.75,6.75 13,5 10.75,5 10,5.75 | D1.C D2.C 66.8,22.7 66.25,23.25 59.5,23.25 58.5,24.25 58.5,27 58.25,27.25 55,27.25 54.5,26.75 54.5,24.25 53.5,23.25 44,23.25 v43.75,23 | D6.C D5.C 3.45,11.2 3.65,11 8.25,11 10,9.25 10,5.75 | IC3.4 37.68,13.82 42,10.25 | 42,10.25 42,0.5 | v43.75,12.75 42,10.25 | S1.P 6.75,2.5 10,5.75
VPREV
  Bottom 0.61: JP5.1 S1.O
(copper drawn outside any net)
  shapes: Top area x4

### Text on the board
Top: A